# EasyEDA Pro project _MSPM0电赛_2025-06-15-官方红板子.epro

# Schematic Schematic1
Board Name: Board1; Create Date: 2025-06-14; Page Name: P1; Project Name: MSPM0电赛; Schematic Name: Schematic1; Update Date: 2025-06-15; Company: 嘉立创EDA; Page Size: A4; Version: V1.0
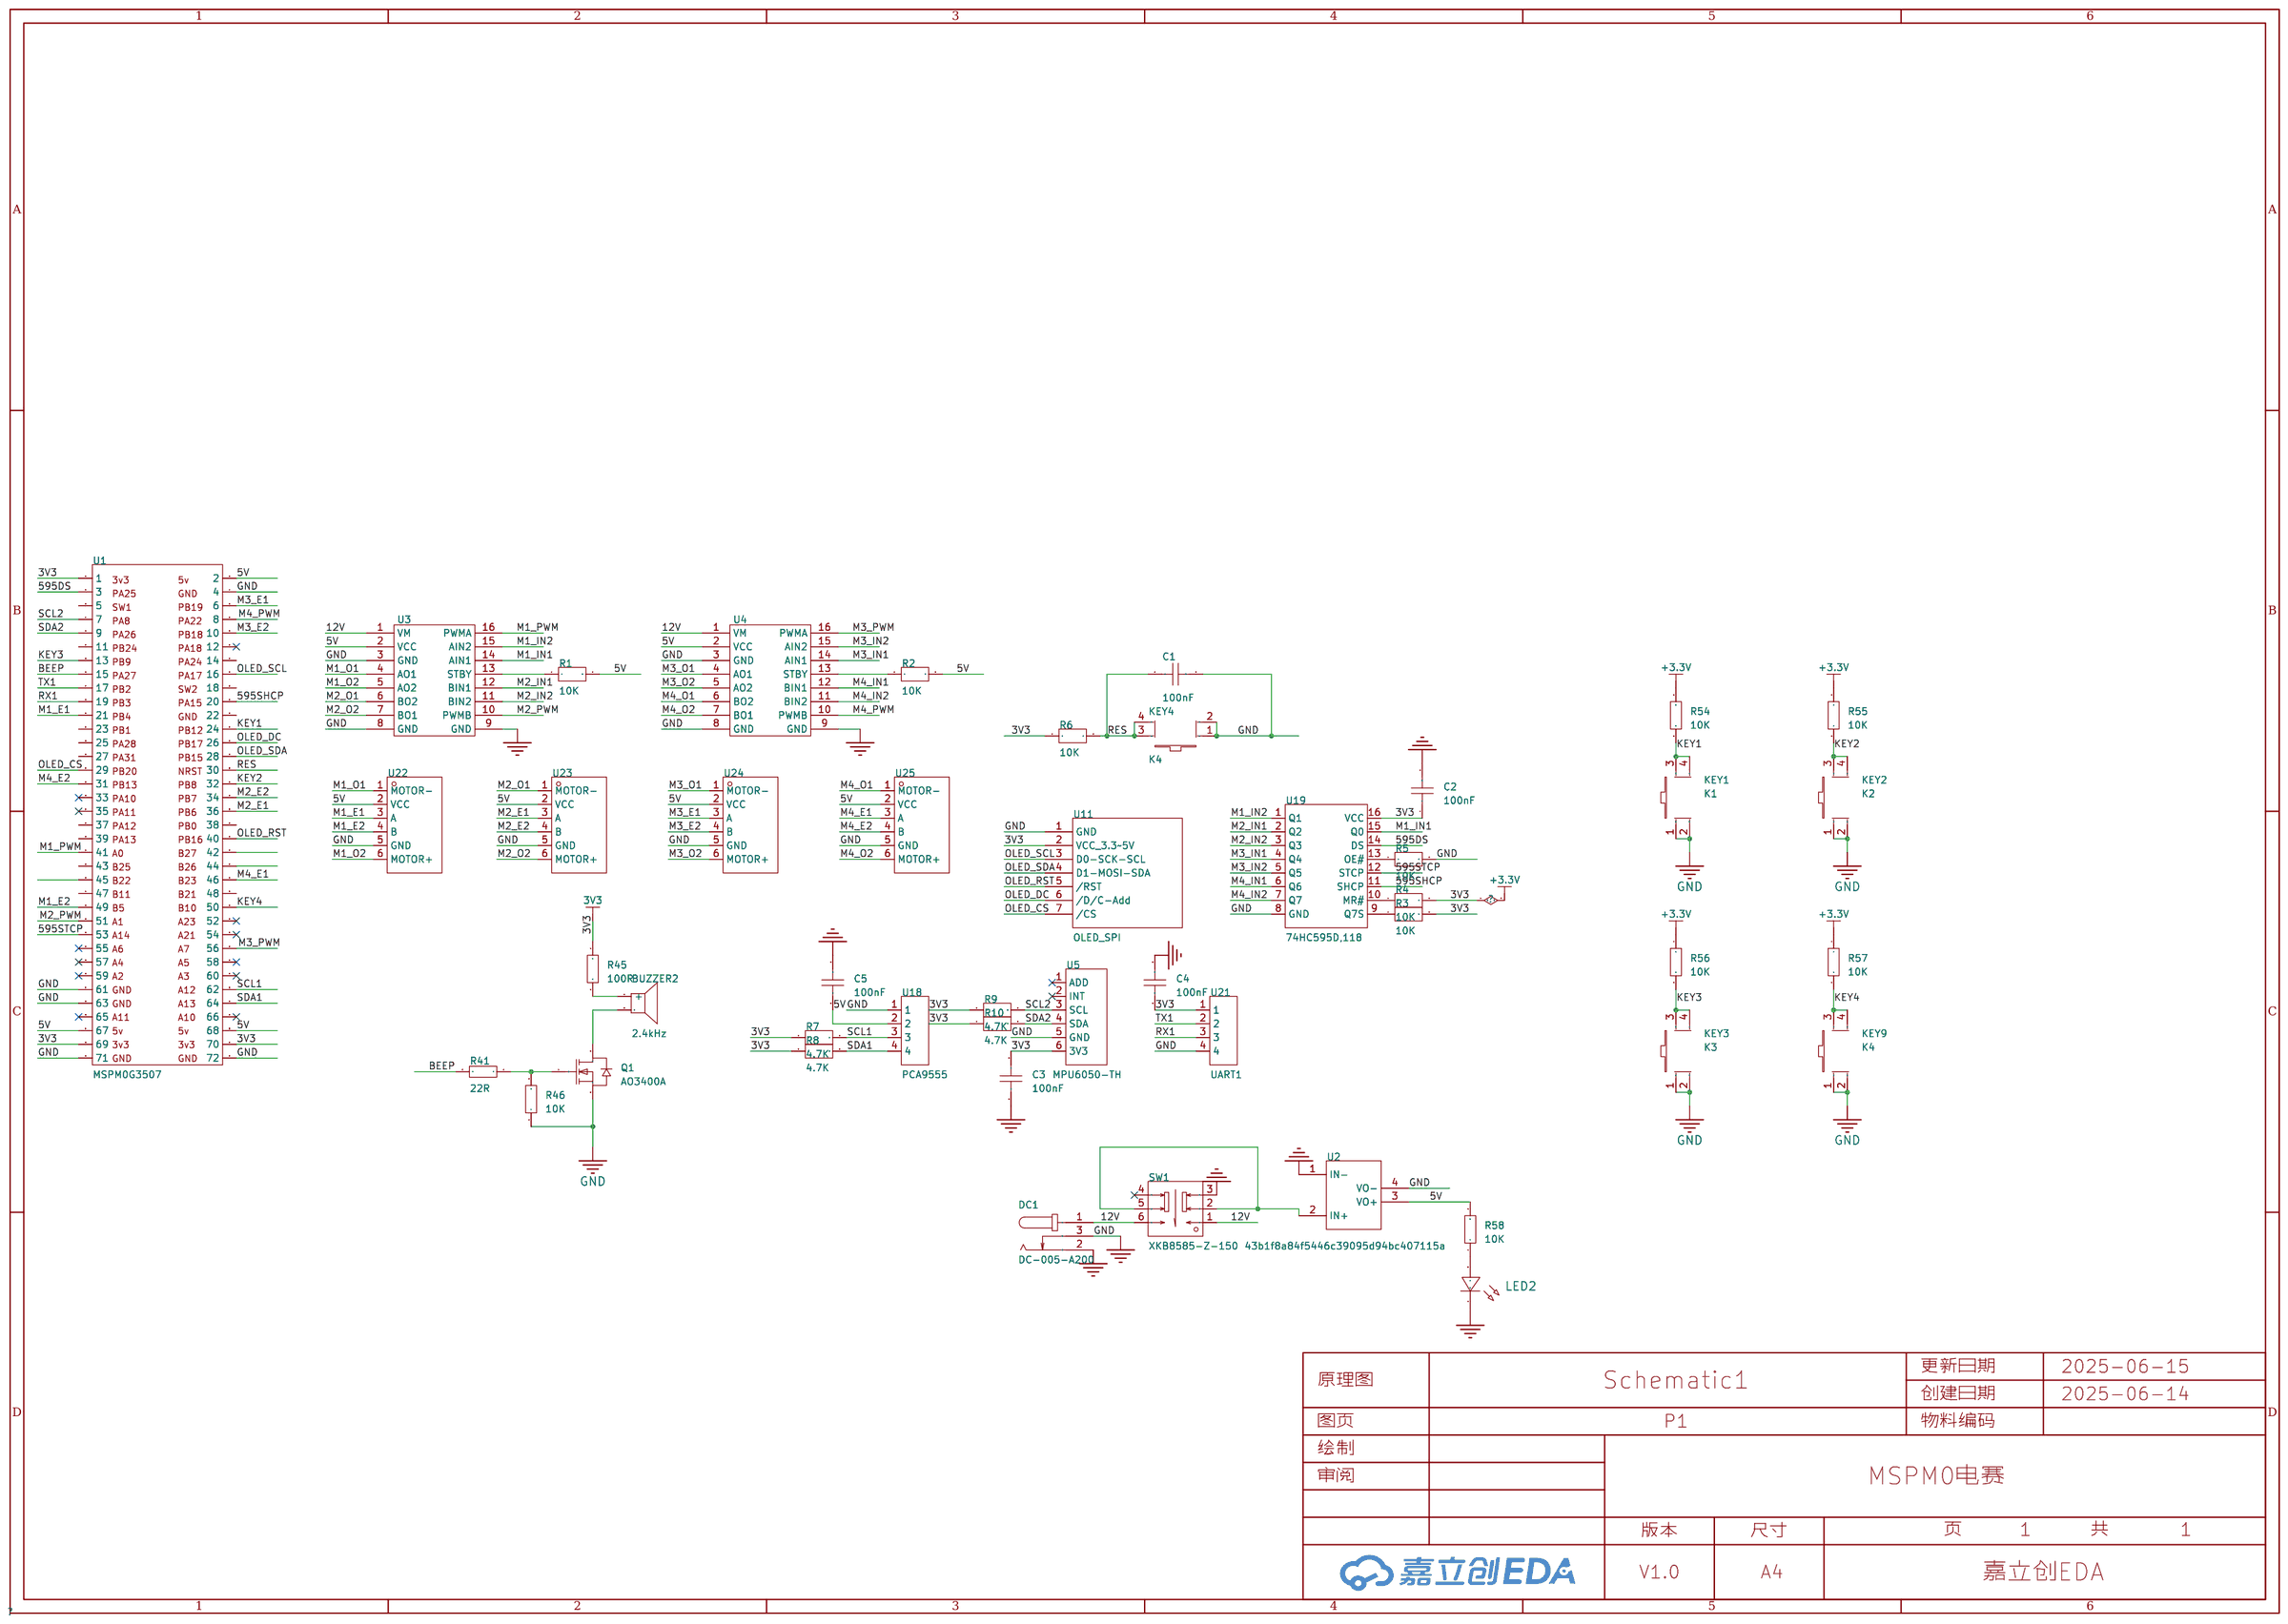
[diagram p0: schematic sheet]

## Parts
BUZZER2  2.4kHz  [BUZ-TH_BD12.0-P7.60-D0.6-FD]
C1  100nF  [C0603]
C2  100nF  [C0603]
C3  100nF  [C0603]
C4  100nF  [C0603]
C5  100nF  [C0603]
DC1  DC-005-A200  [DC-IN-TH_DC-005-A200]
KEY1  K1  [KEY-TH_4P-L6.0-W6.0-P4.50]
KEY2  K2  [KEY-TH_4P-L6.0-W6.0-P4.50]
KEY3  K3  [KEY-TH_4P-L6.0-W6.0-P4.50]
KEY4  K4  [KEY-TH_4P-L6.0-W6.0-P4.50]
KEY9  K4  [KEY-TH_4P-L6.0-W6.0-P4.50]
LED2  -  [LED_0603]
Q1  AO3400A  [SOT-23-3_L2.9-W1.3-P1.90-LS2.4-BR]
R1  10K  [C0603]
R2  10K  [C0603]
R3  10K  [C0603]
R4  10K  [C0603]
R5  10K  [C0603]
R6  10K  [C0603]
R7  4.7K  [C0603]
R8  4.7K  [C0603]
R9  4.7K  [C0603]
R10  4.7K  [C0603]
R41  22R  [R0603]
R45  100R  [R0603]
R46  10K  [R0603]
R54  10K  [R0603]
R55  10K  [R0603]
R56  10K  [R0603]
R57  10K  [R0603]
R58  10K  [R0603]
SW1  XKB8585-Z-150  [SW-TH_6P-L8.5-W8.5-P2.50-LS5.4-BL-1]
U1  MSPM0G3507  [MSPM0G3507]
U2  43b1f8a84f5446c39095d94bc407115a  [AJ41 DC-DC降压电源模块]
U3  -  [TB6612]
U4  -  [TB6612]
U5  MPU6050-TH  [COMM-TH_MPU6050-TH]
U11  OLED_SPI  [0.96OLED_7P]
U18  PCA9555  [CONN-TH_4P-P2.50-XH2.54-4P]
U19  74HC595D,118  [SOIC-16_L9.9-W3.9-P1.27-LS6.0-BL]
U21  UART1  [CONN-TH_4P-P2.50-XH2.54-4P]
U22  -  [ZX-XH2.54-6PWZ]
U23  -  [ZX-XH2.54-6PWZ]
U24  -  [ZX-XH2.54-6PWZ]
U25  -  [ZX-XH2.54-6PWZ]

## Library data of the parts
BUZZER2 = TMB12A05_C96093: 驱动方式:有源(内含驱动线路);构造类型:电磁式;额定电压:-;频率:2.4kHz;声压(SPL):85dB;; LCSC Part Name: TMB12A05; Supplier Part: C96093; Manufacturer: 华能; Manufacturer Part: TMB12A05; Supplier Footprint: 插件,D=12mm; JLCPCB Part Class: 扩展库; Datasheet: https://atta.szlcsc.com/upload/public/pdf/source/20241025/8A17FE04D767D19A35A06DEF9A82AB1E.pdf; Supplier: LCSC; Driver Circuitry: 有源(内含驱动线路); Technology: 电磁式; Voltage - Supply: 4V~8V; Sound Pressure Level(SPL): 85dB; Diameter(φD): 12mm; Height: 9.8mm
C1-C5 = CAP_0603: Supplier Footprint: 0603
DC1 = DC-005-A200: 连接器类型:DC电源插座;安装方式:弯插;触点内径:2mm;触点外径:6.4mm;额定电流:3A;额定电压:30V;工作温度范围:-20℃~+70℃;; LCSC Part Name: DC电源插座 内径:2mm 外径:6.4mm; Supplier Part: C720557; Manufacturer: XUNPU(讯普); Supplier Footprint: 插件; JLCPCB Part Class: 扩展库; Datasheet: https://atta.szlcsc.com/upload/public/pdf/source/20200812/C720557_2286DFCD6C75B71AF905731F627ABF3A.pdf; Supplier: LCSC; Connector Type: DC电源插座; Mounting Style: 弯插; Inside Contact Diameter: 2mm; Outside Contact Diameter: 6.4mm; Current Rating (Max): 3A; Voltage Rating (Max): 30V; Operating Temperature Range: -20℃~+70℃
KEY1-KEY4 KEY9 = 按键开关6*6*8.5: LCSC Part Name: 按键开关6*6*8.5   直插; Supplier Part: C59980; Supplier Footprint: 插件; JLCPCB Part Class: 扩展库; Supplier: LCSC
LED2 = LED_0603-R: Supplier Footprint: 0603
Q1 = AO3400A_C20917: 类型:1个N沟道;漏源电压(Vdss):30V;连续漏极电流(Id):5.7A;导通电阻(RDS(on)@Vgs,Id):26.5mΩ@10V,5.7A;功率(Pd):1.4W;阈值电压(Vgs(th)@Id):1.5V@250uA;; LCSC Part Name: 1个N沟道 耐压:30V 电流:5.7A; Supplier Part: C20917; Manufacturer: AOS; Supplier Footprint: SOT-23-3L; JLCPCB Part Class: 基础库; Datasheet: https://atta.szlcsc.com/upload/public/pdf/source/20140107/1457706668533.pdf; Supplier: LCSC; Type: 1个N沟道; Drain Source Voltage (Vdss): 30V; Continuous Drain Current (Id): 5.7A; Drain Source On Resistance (RDS(on)@Vgs,Id): 26.5mΩ@10V,5.7A; Power Dissipation (Pd): 1.4W; Gate Threshold Voltage (Vgs(th)@Id): 1.5V@250uA; Total Gate Charge (Qg@Vgs): 7nC@4.5V; Input Capacitance (Ciss@Vds): 630pF@15V; Operating Temperature: -55℃~+150℃@(Tj)
R1-R10 = RGT1608P-4990-B-T5: 电阻类型:薄膜电阻;阻值:499Ω;精度:±0.1%;功率:62.5mW;最大工作电压:100V;温度系数:±25ppm/℃;; LCSC Part Name: 薄膜电阻 499Ω ±0.1% 62.5mW; Supplier Part: C2083102; Manufacturer: SUSUMU; Supplier Footprint: 0603; JLCPCB Part Class: 扩展库; Datasheet: https://atta.szlcsc.com/upload/public/pdf/source/20210602/FAF6903AD06801EB9B5BD9535AC54790.pdf; Supplier: LCSC; Type: 薄膜电阻; Tolerance: ±0.1%; Power(Watts): 62.5mW; Overload Voltage (Max): 100V; Temperature Coefficient: ±25ppm/℃; Operating Temperature Range: -55℃~+175℃
R41 R45 R46 R54-R58 = Res_0603: Supplier Footprint: 0603
SW1 = XKB8585-Z-150: 电路结构:-;自锁/无锁:自锁;安装方式:直插;触点电流:100mA;额定电压 (AC):250V;额定电压 (DC):30V;带灯:不带;作用力:160gf;机械寿命:10万次;; LCSC Part Name: 按键开关   六脚 内扣 有声自锁; Supplier Part: C318850; Manufacturer: XKB Connectivity(中国星坤); Supplier Footprint: 插件; JLCPCB Part Class: 扩展库; Datasheet: https://atta.szlcsc.com/upload/public/pdf/source/20200227/C318850_BEC742BC33DEE736D7E5FB22B903A157.pdf; Supplier: LCSC; Self Lock / No Lock: 自锁; Actuator Style: 方形按钮; Mounting Style: 直插; Contact Current: 100mA; Voltage Rating (AC): 250V; Voltage Rating (DC): 30V; Insulation Resistance: 100MΩ; Actuator/Cap Color: 白色; With Lamp: 不带; Pin Style: PC引脚; Operating Force: 160gf; Operating Temperature: -15℃~+55℃; Mechanical Life: 10万次
U1 = MSPM0G3507: _: 3
U2 = AJ41 DC-DC降压电源模块: AJ41 DC-DC降压电源模块 6V-36V转5V
U3 U4 = TB6612
U5 = MPU6050-TH: Supplier Part: C9900132629; Supplier Footprint: 直插; Supplier: LCSC
U11 = OLED_7P: Pin Type: IN
U18 U21 = XH2.54_4P_直插: Supplier Part: C9900008616; Supplier Footprint: XH2.54_4P; JLCPCB Part Class: 扩展库; Supplier: LCSC
U19 = 74HC595D,118: 功能:串行至串行或并行;电源电压:2V~6V;元件数:1;每个元件位数:8;; LCSC Part Name: 三态输出 串行至串行或并行移位寄存器; Supplier Part: C5947; Manufacturer: Nexperia(安世); Supplier Footprint: SOIC-16; JLCPCB Part Class: 基础库; Datasheet: https://atta.szlcsc.com/upload/public/pdf/source/20240724/C3A3241CA190230F407C83CEC4244600.pdf; Supplier: LCSC; Function: 串行至串行或并行; Supply Voltage: 2V~6V; Number of Elements: 1; Number of Bits per Element: 8; Output Type: 三态; Series: 74HC; Operating Temperature: -40℃~+125℃
U22-U25 = Motor-6Pin

## Nets
5V: C5.2 R1.2 R2.2 R58.2 U1.2 U1.67 U1.68 U2.3(VO+) U3.2(VCC) U4.2(VCC) U18.2 U22.2(VCC) U23.2(VCC) U24.2(VCC) U25.2(VCC)
12V: DC1.1 SW1.1 SW1.6 U3.1(VM) U4.1(VM)
+3.3V: C2.1 C3.2 C4.1 R3.2 R4.2 R6.1 R7.1 R8.1 R9.1 R10.1 R45.1 R54.1 R55.1 R56.1 R57.1 U1.1 U1.69 U1.70 U5.6(3V3) U11.2(VCC 3.3~5V) U19.16(VCC) U21.1
GND: C1.2 C2.2 C3.1 C4.2 C5.1 DC1.2 DC1.3 KEY1.1 KEY1.2 KEY2.1 KEY2.2 KEY3.1 KEY3.2 KEY4.1 KEY4.2 KEY9.1 KEY9.2 LED2.1(C) Q1.2(S) R5.2 R46.1 SW1.3 U1.4 U1.61 U1.63 U1.71 U1.72 U2.1(IN-) U2.4(VO-) U3.3(GND) U3.8(GND) U3.9(GND) U4.3(GND) U4.8(GND) U4.9(GND) U5.5(GND) U11.1(GND) U18.1 U19.8(GND) U21.4 U22.5(GND) U23.5(GND) U24.5(GND) U25.5(GND)
595DS: U1.3 U19.14(DS)
595SHCP: U1.20 U19.11(SHCP)
595STCP: U1.53 U19.12(STCP)
BEEP: R41.2 U1.15
KEY1: KEY1.3 KEY1.4 R54.2 U1.24
KEY2: KEY2.3 KEY2.4 R55.2 U1.32
KEY3: KEY3.3 KEY3.4 R56.2 U1.13
KEY4: KEY9.3 KEY9.4 R57.2 U1.50
M1_E1: U1.21 U22.3(A)
M1_E2: U1.49 U22.4(B)
M1_IN1: U3.14(AIN1) U19.15(Q0)
M1_IN2: U3.15(AIN2) U19.1(Q1)
M1_O1: U3.4(AO1) U22.1(MOTOR-)
M1_O2: U3.5(AO2) U22.6(MOTOR+)
M1_PWM: U1.41 U3.16(PWMA)
M2_E1: U1.36 U23.3(A)
M2_E2: U1.34 U23.4(B)
M2_IN1: U3.12(BIN1) U19.2(Q2)
M2_IN2: U3.11(BIN2) U19.3(Q3)
M2_O1: U3.6(BO2) U23.1(MOTOR-)
M2_O2: U3.7(BO1) U23.6(MOTOR+)
M2_PWM: U1.51 U3.10(PWMB)
M3_E1: U1.6 U24.3(A)
M3_E2: U1.10 U24.4(B)
M3_IN1: U4.14(AIN1) U19.4(Q4)
M3_IN2: U4.15(AIN2) U19.5(Q5)
M3_O1: U4.4(AO1) U24.1(MOTOR-)
M3_O2: U4.5(AO2) U24.6(MOTOR+)
M3_PWM: U1.56 U4.16(PWMA)
M4_E1: U1.46 U25.3(A)
M4_E2: U1.31 U25.4(B)
M4_IN1: U4.12(BIN1) U19.6(Q6)
M4_IN2: U4.11(BIN2) U19.7(Q7)
M4_O1: U4.6(BO2) U25.1(MOTOR-)
M4_O2: U4.7(BO1) U25.6(MOTOR+)
M4_PWM: U1.8 U4.10(PWMB)
OLED_CS: U1.29 U11.7(/CS)
OLED_DC: U1.26 U11.6(/D/C-Add)
OLED_RST: U1.40 U11.5(/RST)
OLED_SCL: U1.16 U11.3(D0-SCK-SCL)
OLED_SDA: U1.28 U11.4(D1-MOSI-SDA)
RES: C1.1 KEY4.3 KEY4.4 R6.2 U1.30
RX1: U1.19 U21.3
SCL1: R7.2 U1.62 U18.3
SCL2: R9.2 U1.7 U5.3(SCL)
SDA1: R8.2 U1.64 U18.4
SDA2: R10.2 U1.9 U5.4(SDA)
TX1: U1.17 U21.2
$1N3300: R1.1 U3.13(STBY)
$1N3306: R2.1 U4.13(STBY)
$1N3954: R3.1 U19.9(Q7S)
$1N3999: R4.1 U19.10(MR#)
$1N4038: R5.1 U19.13(OE#)
$1N7175: BUZZER2.2 Q1.3(D)
$1N7178: Q1.1(G) R41.1 R46.2
$1N7182: BUZZER2.1(+) R45.2
$1N9172: LED2.2(A) R58.1
$1N10907: SW1.2 SW1.5 U2.2(IN+)

Not connected (* = marked no-connect by the designer): SW1 4*; U1 5 11 12* 14 18 22 23 25 27 33* 35* 37 38 39 42 43 44 45 47 48 52* 54* 55* 57* 58* 59* 60* 65* 66*; U5 1(ADD)* 2(INT)*

# Board PCB1
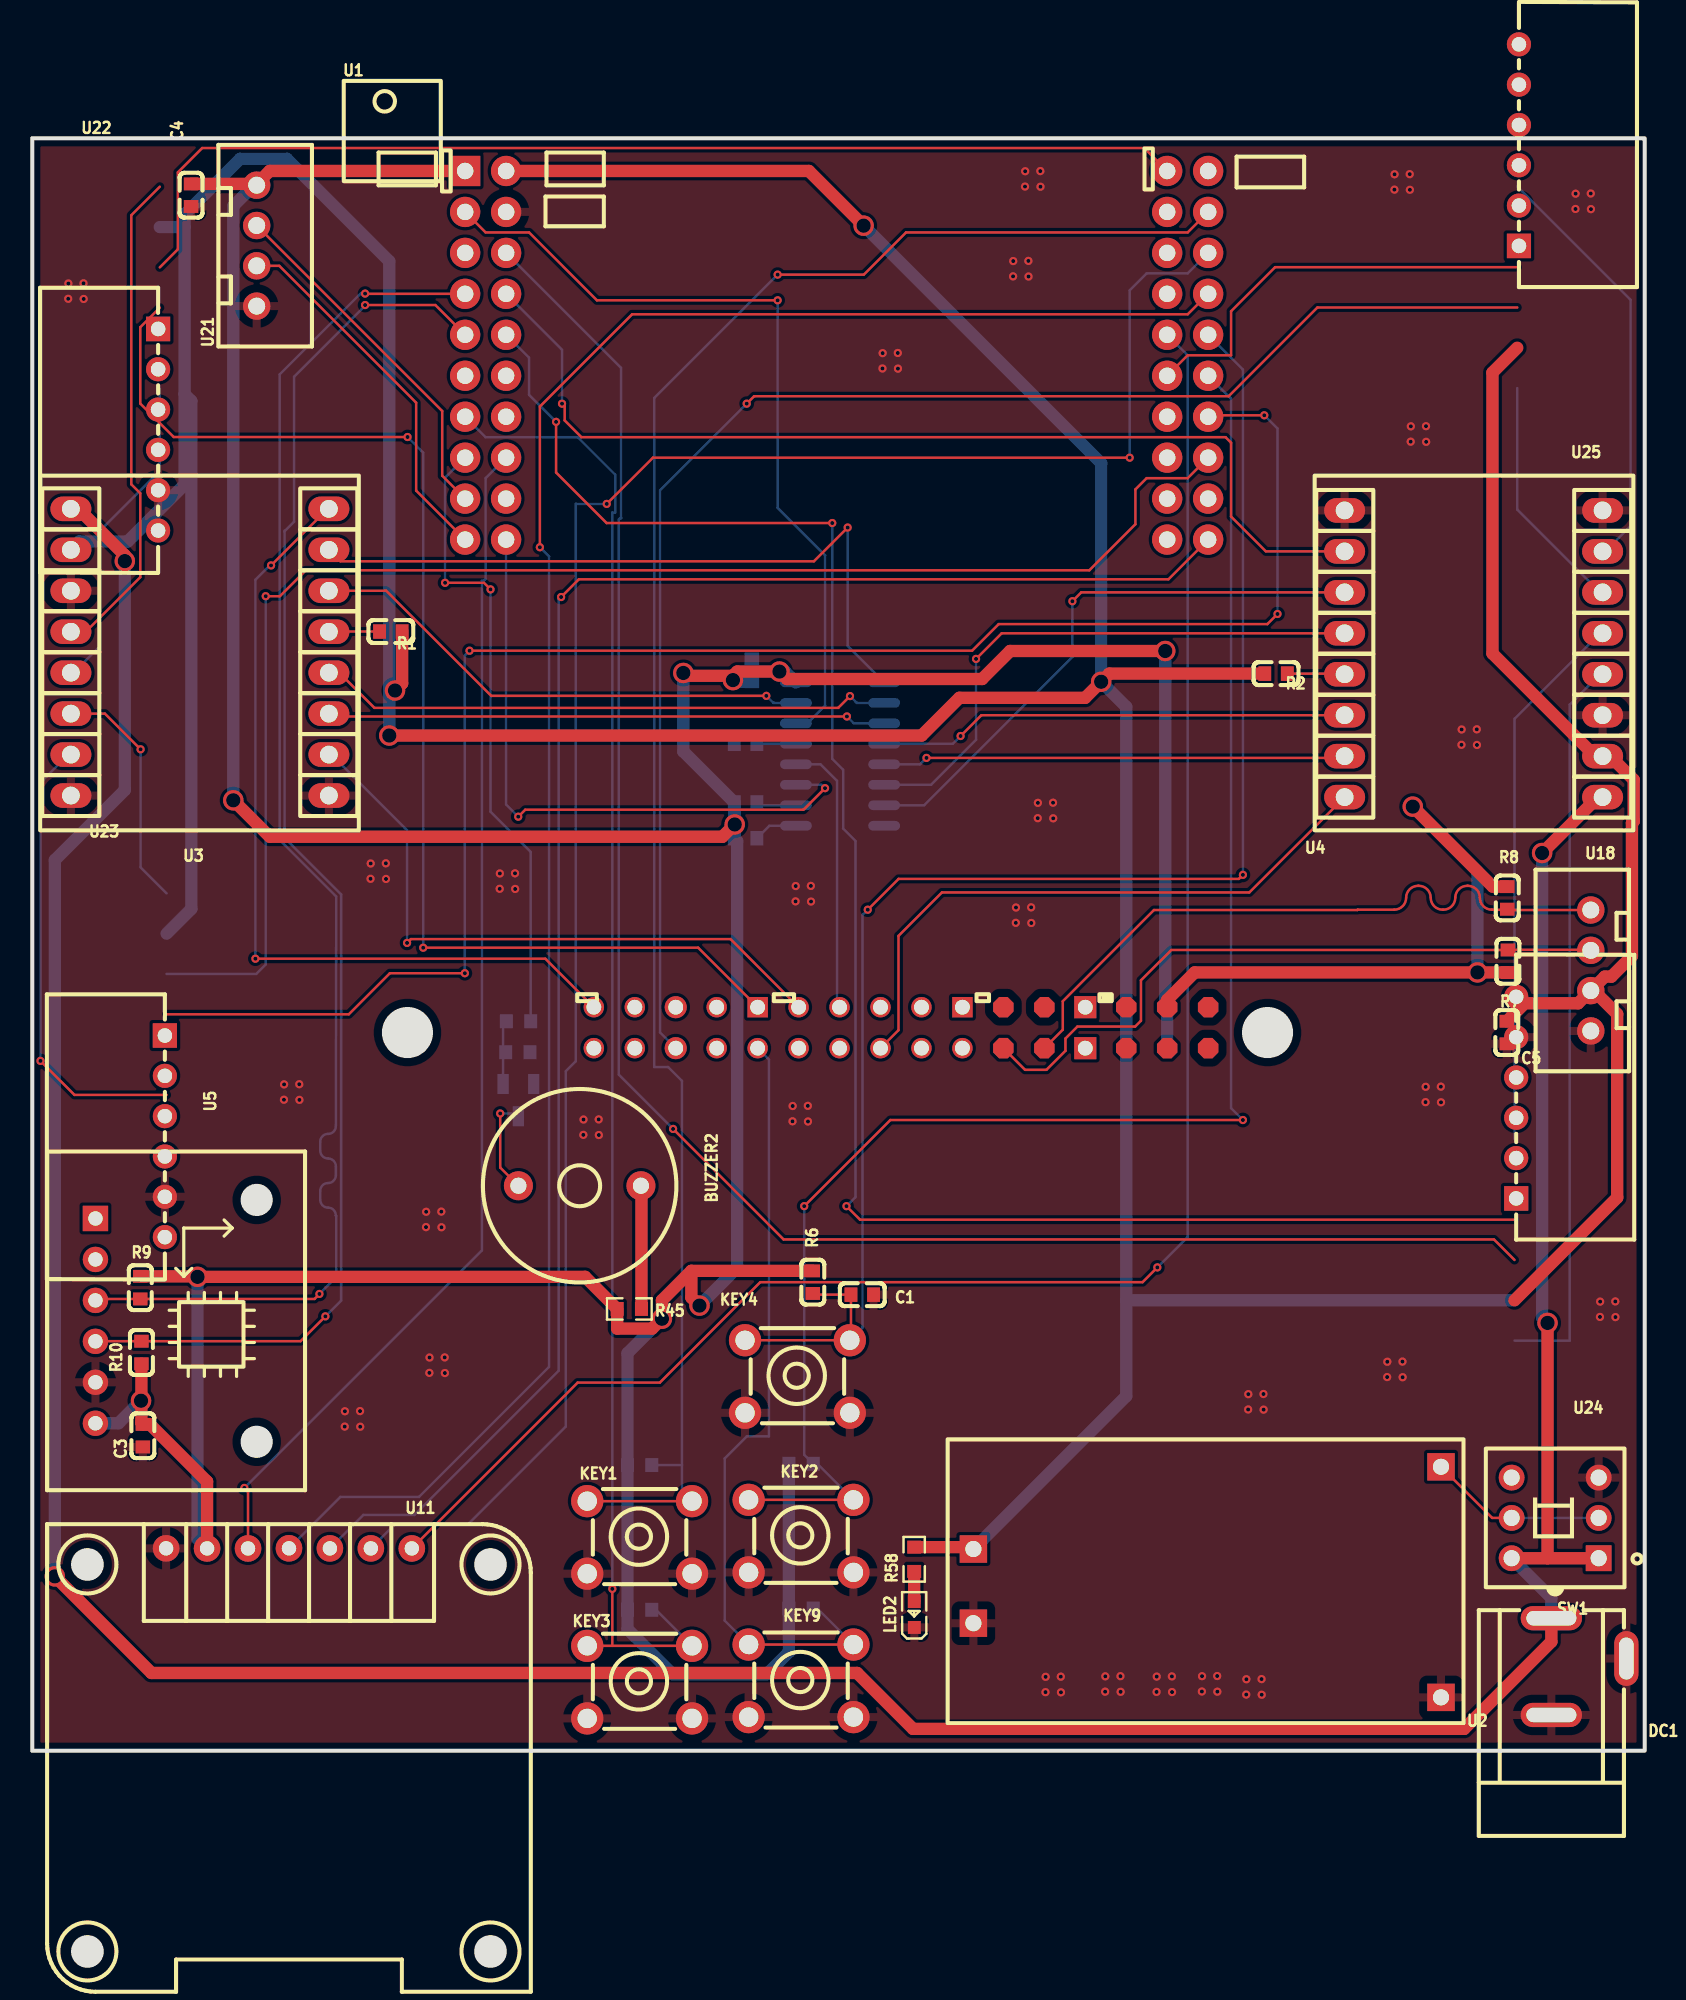
[diagram p1: board, top side]
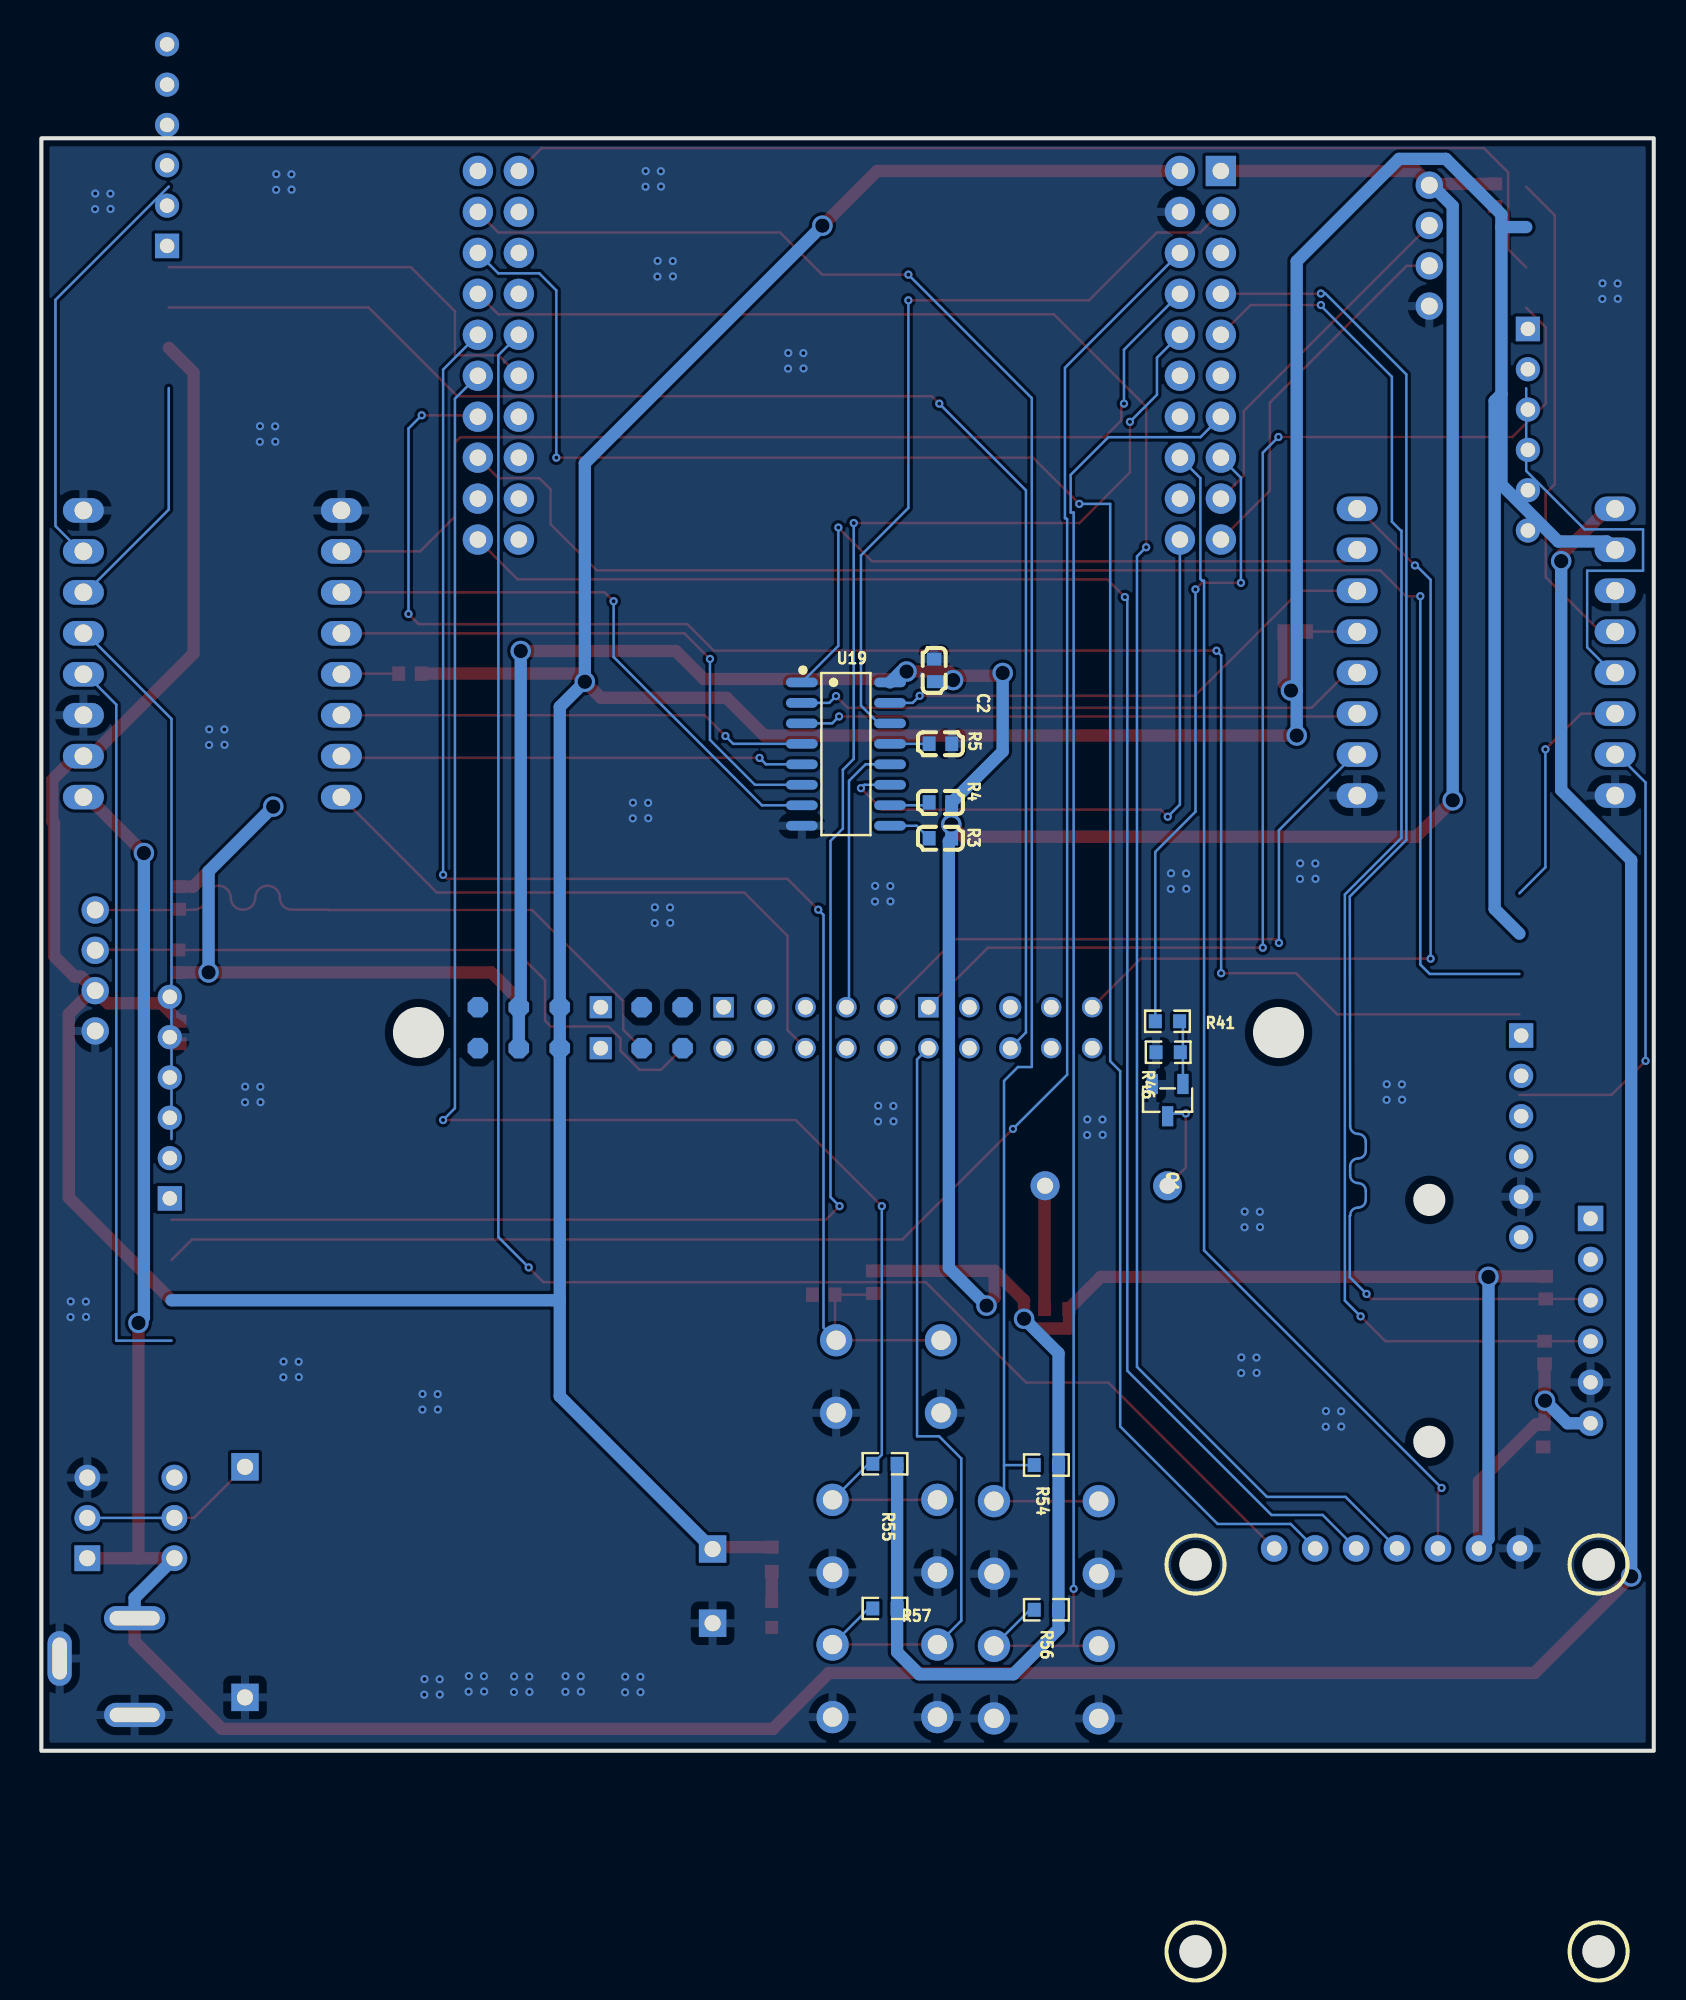
[diagram p2: board, bottom side, seen from below]

Outline 100 x 113.46 mm; copper layers: Top Layer, Bottom Layer. Coordinates in mm from the lower left corner of the outline.
Outline path: rectangle 0,113.46 100,13.46
Stack: Top Layer 0.035mm / Dielectric1 1.51mm FR4 er 4.5 / Bottom Layer 0.035mm

## Design rules (mm)
net SCL2: DP1
net SDA2: DP1
net GND: GND
net 5V: PWO
net SCL1: DP2
net SDA1: DP2
net 12V: PPWO
net $1N7182: PWO
net +3.3V: PWO
net $1N9172: PWO
template: 双
spacing copperThickness1oz (default): track to track 0.203, other pairs 0.152 to 0.203
spacing copperThickness2oz: track to track 0.203, other pairs 0.152 to 0.3
track width 信号线 (default): min 0.152, default 0.152, max 0.152
track width 电源线: min 0.762, default 0.762, max 0.762
differential pair differentialPair (default): width min 0.152, default 0.152, max 0.152; gap min 0.152, default 0.152
via 信号线孔 (default): diameter min 0.508, default 0.508, max 0.508; hole min 0.254, default 0.254, max 0.305
via 电源: diameter min 0.762, default 1.27, max 2.032; hole min 0.762, default 0.889, max 2.032
net class PWO uses 电源, 电源线
net class PPWO uses 电源, 电源线
net 5V uses 电源, 电源线
net 12V uses 电源, 电源线
net $1N7182 uses 电源, 电源线
net +3.3V uses 电源, 电源线
net $1N9172 uses 电源, 电源线

## Placement (name value [footprint] x y rotation side)
BUZZER2  2.4kHz  [BUZ-TH_BD12.0-P7.60-D0.6-FD]  33.95 48.5 180 top
C1  100nF  [C0603]  51.48 41.74 0 top
C2  100nF  [C0603]  44.63 80.46 90 bottom
C3  100nF  [C0603]  6.86 33 90 top
C4  100nF  [C0603]  9.85 109.93 270 top
C5  100nF  [C0603]  91.45 58 90 top
DC1  DC-005-A200  [DC-IN-TH_DC-005-A200]  96.54 18.68 90 top
KEY1  K1  [KEY-TH_4P-L6.0-W6.0-P4.50]  37.67 26.69 0 top
KEY2  K2  [KEY-TH_4P-L6.0-W6.0-P4.50]  47.68 26.77 0 top
KEY3  K3  [KEY-TH_4P-L6.0-W6.0-P4.50]  37.67 17.71 0 top
KEY4  K4  [KEY-TH_4P-L6.0-W6.0-P4.50]  47.46 36.66 0 top
KEY9  K4  [KEY-TH_4P-L6.0-W6.0-P4.50]  47.68 17.79 0 top
LED2  -  [LED_0603]  54.7 21.96 90 top
Q1  AO3400A  [SOT-23-3_L2.9-W1.3-P1.90-LS2.4-BR]  30.15 53.81 90 bottom
R1  10K  [C0603]  22.24 82.87 0 top
R2  10K  [C0603]  77.14 80.26 180 top
R3  10K  [C0603]  44.24 70.05 180 bottom
R4  10K  [C0603]  44.24 72.27 180 bottom
R5  10K  [C0603]  44.24 75.91 180 bottom
R6  10K  [C0603]  48.41 42.52 270 top
R7  4.7K  [C0603]  91.52 62.42 90 top
R8  4.7K  [C0603]  91.48 66.35 270 top
R9  4.7K  [C0603]  6.7 42.18 270 top
R10  4.7K  [C0603]  6.77 38.16 90 top
R41  22R  [R0603]  30.16 58.7 0 bottom
R45  100R  [R0603]  37.03 40.86 0 top
R46  10K  [R0603]  30.12 56.78 180 bottom
R54  10K  [R0603]  37.67 31.17 0 bottom
R55  10K  [R0603]  47.68 31.25 0 bottom
R56  10K  [R0603]  37.67 22.2 0 bottom
R57  10K  [R0603]  47.68 22.28 0 bottom
R58  10K  [R0603]  54.7 25.33 90 top
SW1  XKB8585-Z-150  [SW-TH_6P-L8.5-W8.5-P2.50-LS5.4-BL-1]  94.45 27.9 90 top
U1  -  [MSPM0G3507]  47.26 86.54 0 top
U2  43b1f8a84f5446c39095d94bc407115a  [AJ41 DC-DC降压电源模块]  73.47 24.57 180 top
U3  -  [TB6612]  0.34 70.49 0 top
U4  -  [TB6612]  99.45 92.59 180 top
U5  MPU6050-TH  [COMM-TH_MPU6050-TH]  3.92 40.12 270 top
U11  OLED_SPI  [0.96OLED_7P]  15.92 26.01 0 top
U18  PCA9555  [CONN-TH_4P-P2.50-XH2.54-4P]  96.66 61.85 270 top
U19  74HC595D,118  [SOIC-16_L9.9-W3.9-P1.27-LS6.0-BL]  50.1 75.27 270 bottom
U21  UART1  [CONN-TH_4P-P2.50-XH2.54-4P]  13.92 106.8 90 top
U22  -  [ZX-XH2.54-6PWZ]  7.91 104.21 270 top
U23  -  [ZX-XH2.54-6PWZ]  8.33 60.39 270 top
U24  -  [ZX-XH2.54-6PWZ]  91.93 45.14 90 top
U25  -  [ZX-XH2.54-6PWZ]  92.1 104.21 90 top

## Footprints (pads in the part's own frame, mm; a bottom-side part is the same pattern mirrored in y, then rotated)
0.96OLED_7P
  round 1.651 hole 0.889: 1(-7.617,0.003) 2(-5.077,-0.003) 3(-2.538,-0.003) 4(0.003,0.005) 5(2.54,0) 6(5.08,0) 7(7.62,-0.003)
AJ41 DC-DC降压电源模块
  rect 1.7x1.7 hole 1: 1(-13.9,7.8) 2(-13.9,-6.5) 3(15.1,-1.4) 4(15.1,3.2)
BUZ-TH_BD12.0-P7.60-D0.6-FD
  round 1.8 hole 1: 1(-3.8,0) 2(3.8,0)
C0603
  rect 0.8x0.9 smd: 1(-0.7,0) 2(0.7,0)
COMM-TH_MPU6050-TH
  rect 1.575x1.575 hole 0.889: 1(-6.35,0)
  round 1.575 hole 0.889: 2(-3.81,0) 3(-1.27,0) 4(1.27,0) 5(3.81,0) 6(6.35,0)
CONN-TH_4P-P2.50-XH2.54-4P
  round 1.7 hole 1.05: 1(3.75,0) 2(1.25,0) 3(-1.25,0) 4(-3.75,0)
DC-IN-TH_DC-005-A200
  oval 1.5x3.8 hole 0.9x3.1: 1(3,2.325) 2(-3,2.325)
  oval 3.4x1.5 hole 2.6x0.9: 3(0.5,-2.325)
KEY-TH_4P-L6.0-W6.0-P4.50
  round 2 hole 1.2: 1(-3.25,-2.25) 2(3.25,-2.25) 3(3.25,2.25) 4(-3.25,2.25)
LED_0603
  rect 0.8x0.8 smd: 1(-0.851,-0.01) 2(0.75,-0.005)
MSPM0G3507
  rect 1.879x1.879 hole 1.021x1.016: 1(-20.412,24.892)
  round 1.879 hole 1.021x1.016: 2(-17.872,24.892) 3(-20.412,22.352) 4(-17.872,22.352) 5(-20.412,19.812) 6(-17.872,19.812) 7(-20.412,17.272) 8(-17.872,17.272) 9(-20.412,14.732) 10(-17.872,14.732) 11(-20.412,12.192) 12(-17.872,12.192) 13(-20.412,9.652) 14(-17.872,9.652) 15(-20.412,7.112) 16(-17.872,7.112) 17(-20.412,4.572) 18(-17.872,4.572) 19(-20.412,2.032) 20(-17.872,2.032) 21(23.128,24.892) 22(25.668,24.892) 23(23.128,22.352) 24(25.668,22.352) 25(23.128,19.812) 26(25.668,19.812) 27(23.128,17.272) 28(25.668,17.272) 29(23.128,14.732) 30(25.668,14.732) 31(23.128,12.192) 32(25.668,12.192) 33(23.128,9.652) 34(25.668,9.652) 35(23.128,7.112) 36(25.668,7.112) 37(23.128,4.572) 38(25.668,4.572) 39(23.128,2.032) 40(25.668,2.032)
  round 1.267 hole 0.919x0.914: 41(-12.431,-26.968) 42(-12.431,-29.508) 43(-9.892,-26.968) 44(-9.892,-29.508) 47(-4.811,-26.968) 48(-4.811,-29.508) 50(-2.272,-29.508) 51(0.269,-26.968) 52(0.269,-29.508) 53(2.808,-26.968) 54(2.808,-29.508) 55(5.348,-26.968) 56(5.348,-29.508) 57(7.888,-26.968) 58(7.888,-29.508) 60(10.428,-29.508)
  round 1.371 hole 0.919x0.914: 45(-7.351,-26.968) 46(-7.351,-29.508)
  rect 1.267x1.267 hole 0.919x0.914: 49(-2.272,-26.968) 59(10.428,-26.968)
  custom 1.268x1.267 hole 0.919x0.914: 61(12.969,-26.968) 62(12.969,-29.508) 63(15.508,-26.968) 64(15.508,-29.508) 67(20.588,-26.968) 68(20.588,-29.508) 69(23.128,-26.968) 70(23.128,-29.508) 72(25.669,-29.508)
  rect 1.371x1.371 hole 0.919x0.914: 65(18.049,-26.968) 66(18.049,-29.508)
  custom 1.268x1.267 hole 0.914x0.919: 71(25.668,-26.968)
R0603
  rect 0.806x0.864 smd: 1(-0.753,0) 2(0.753,0)
SOIC-16_L9.9-W3.9-P1.27-LS6.0-BL
  oval 0.602x1.971 smd: 1(-4.445,-2.736) 2(-3.175,-2.736) 3(-1.905,-2.736) 4(-0.635,-2.736) 5(0.635,-2.736) 6(1.905,-2.736) 7(3.175,-2.736) 8(4.445,-2.736) 9(4.445,2.736) 10(3.175,2.736) 11(1.905,2.736) 12(0.635,2.736) 13(-0.635,2.736) 14(-1.905,2.736) 15(-3.175,2.736) 16(-4.445,2.736)
SOT-23-3_L2.9-W1.3-P1.90-LS2.4-BR
  rect 1.25x0.7 smd: 1(1,-0.95) 2(1,0.95) 3(-1,0)
SW-TH_6P-L8.5-W8.5-P2.50-LS5.4-BL-1
  rect 1.6x1.6 hole 1: 1(-2.5,-2.7)
  round 1.6 hole 1: 2(0,-2.7) 3(2.5,-2.7) 4(2.5,2.7) 5(0.001,2.7) 6(-2.5,2.7)
TB6612
  oval 2.54x1.524 hole 1.1: 1(2.057,19.988) 2(2.057,17.448) 3(2.057,14.908) 4(2.057,12.368) 5(2.057,9.828) 6(2.057,7.288) 7(2.057,4.748) 8(2.057,2.208) 9(18.057,2.208) 10(18.057,4.748) 11(18.057,7.288) 12(18.057,9.828) 13(18.057,12.368) 14(18.057,14.908) 15(18.057,17.448) 16(18.057,19.988)
ZX-XH2.54-6PWZ
  rect 1.524x1.5 hole 0.9: 1(2.575,-0.104)
  round 1.5 hole 0.9: 2(5.074,-0.104) 3(7.574,-0.104) 4(10.075,-0.104) 5(12.575,-0.104) 6(15.075,-0.104)

## Nets
As in the schematic.

Pads without a net: SW1 4; U1 5 11 12 14 18 22 23 25 27 33 35 37 38 39 43 47 48 52 54 55 57 58 59 60 65 66; U5 1 2

## Via types
v1: diameter 0.508, hole 0.254, Top Layer to Bottom Layer, 160 vias
v2: diameter 1.27, hole 0.889, Top Layer to Bottom Layer, 20 vias

## Routing (per net, layer and track width the routed paths; a pad name or vN(x,y) marks a point on that pad's centre or on a via; arc(x,y) is an arc through that point)
5V: length 386.3
  Top Layer w0.762: U2.3 58.25,26.08 R58.2 ; U18.2 96.84,60.6 98.3,59.14 98.3,47.76 91.93,41.39 ; U18.2 95.88,59.81 92.57,59.81 C5.2 ; U18.2 97.53,61.47 97.94,61.47 99.21,62.74 99.21,70.99 99.32,71.1 99.32,73.67 97.86,75.14 U4.2 96.93,75.14 90.56,81.5 90.56,98.93 92.1,100.46 ; v2(51.56,108.04) 48.17,111.43 U1.2 ; v2(22.5,79.21) 22.94,79.65 R1.2 ; v2(22.14,76.42) 55.16,76.42 57.5,78.76 65.3,78.76 v2(66.29,79.75) 66.8,80.26 R2.2
  Bottom Layer w0.762: 22.14,79.21 22.14,105.83 15.8,112.18 12.89,112.18 9.45,108.73 9.45,107.95 ; 22.14,79.21 v2(22.5,79.21) ; 22.14,79.21 v2(22.14,76.42) ; 67.85,41.39 91.93,41.39 ; 67.85,41.39 67.85,35.45 U2.3 ; 67.85,41.39 U1.68 U1.67 67.85,78.2 v2(66.29,79.75) 66.29,93.3 v2(51.56,108.04) ; 9.45,97.59 9.45,91.98 5.92,88.45 2.92,88.45 U3.2 ; 9.45,97.59 9.45,107.95 ; 9.45,97.59 9.87,97.17 9.87,65.67 8.33,64.13 ; 9.45,107.95 7.91,107.95
12V: length 229.3
  Top Layer w0.762: U4.1 97.11,72.6 v2(93.64,69.13) ; 93.98,25.4 SW1.1 ; 93.98,25.4 SW1.6 ; 93.98,25.4 v2(93.98,39.99) ; U3.1 2.86,90.48 5.74,87.6 v2(5.74,87.23) ; DC1.1 94.21,20.22 88.8,14.81 54.63,14.81 51.16,18.28 7.39,18.28 v2(1.4,24.27)
  Bottom Layer w0.762: v2(93.98,39.99) 93.64,40.33 v2(93.64,69.13) ; v2(5.74,87.23) 5.74,73.04 1.4,68.7 v2(1.4,24.27) ; DC1.1 94.21,22.93 SW1.6
+3.3V: length 357.9
  Top Layer w0.762: 91.52,61.73 v2(89.63,61.73) 72.09,61.73 70.39,60.02 U1.69 ; R8.1 90.58,67.05 v2(85.62,72.01) ; R9.1 10.22,42.88 v2(10.25,42.85) 34.29,42.85 R45.1 36.28,39.64 38.44,39.64 v2(39.05,40.25) 39.05,41.39 40.88,43.22 ; 43.46,80.12 40.55,80.12 v2(40.38,80.3) ; 43.46,80.12 v2(43.46,79.85) ; 43.46,80.12 43.72,80.39 v2(46.34,80.39) 46.8,79.92 58.91,79.92 60.65,81.66 v2(70.27,81.66) ; 13.92,110.63 14.72,111.43 U1.1 ; 13.92,110.63 C4.1 ; 13.92,110.63 U21.1 ; R6.1 40.88,43.22 ; 40.88,43.22 40.88,41.57 v2(41.38,41.06) ; v2(43.57,70.9) 42.8,70.14 14.73,70.14 v2(12.47,72.4) ; 6.77,35.16 6.77,33.79 C3.2 7.3,33.7 10.84,30.16 U11.2 ; 6.77,35.16 R10.1 ; 6.77,35.16 v2(6.75,35.16)
  Bottom Layer w0.762: v2(12.47,72.4) 12.47,109.26 13.76,110.55 U21.1 ; C2.1 43.55,79.76 v2(43.46,79.85) ; v2(89.63,61.73) 89.63,68 v2(85.62,72.01) ; v2(10.25,42.85) 10.25,26.6 U11.2 ; v2(46.34,80.39) 46.69,80.39 U19.16 ; v2(41.38,41.06) 43.72,43.4 43.72,69.87 R3.2 R4.2 ; U1.70 U1.69 70.27,59.69 v2(70.27,81.66) ; v2(39.05,40.25) 36.92,38.11 R54.1 R56.1 36.92,21 39.72,18.2 45.55,18.2 46.93,19.57 R57.1 R55.1 ; v2(40.38,80.3) 40.38,75.43 R4.2 ; v2(6.75,35.16) 5.35,33.77 U5.6 ; R4.2 43.57,72.24 v2(43.57,70.9)
GND:
  vias: v1(2.24,104.45) v1(2.23,103.5) v1(3.18,104.46) v1(3.19,103.49) v1(15.62,54.78) v1(15.61,53.83) v1(16.56,54.79) v1(16.57,53.82) v1(19.39,34.51) v1(19.38,33.56) v1(20.33,34.52) v1(20.34,33.55) v1(20.99,68.48) v1(20.98,67.53) v1(21.93,68.49) v1(21.94,67.52) v1(24.43,46.88) v1(24.42,45.93) v1(24.64,37.84) v1(24.63,36.89) v1(25.37,46.89) v1(25.38,45.92) v1(25.58,37.85) v1(25.59,36.88) v1(29,67.86) v1(28.99,66.91) v1(29.94,67.87) v1(29.95,66.9) v1(34.19,52.6) v1(34.18,51.65) v1(35.13,52.61) v1(35.14,51.64) v1(47.16,53.44) v1(47.15,52.49) v1(47.35,67.08) v1(47.34,66.13) v1(48.1,53.45) v1(48.11,52.48) v1(48.29,67.09) v1(48.3,66.12) v1(52.74,100.13) v1(52.73,99.18) v1(53.68,100.14) v1(53.69,99.17) v1(60.84,105.84) v1(60.83,104.89) v1(61.01,65.75) v1(61,64.8) v1(61.58,111.41) v1(61.57,110.46) v1(61.78,105.85) v1(61.79,104.88) v1(61.95,65.76) v1(61.96,64.79) v1(62.37,72.24) v1(62.36,71.29) v1(62.52,111.42) v1(62.53,110.45) v1(62.85,18.04) v1(62.84,17.09) v1(63.31,72.25) v1(63.32,71.28) v1(63.79,18.05) v1(63.8,17.08) v1(66.54,17.12) v1(66.55,18.07) v1(67.49,18.08) v1(67.5,17.11) v1(69.74,18.06) v1(69.73,17.11) v1(70.68,18.07) v1(70.69,17.1) v1(72.54,17.13) v1(72.55,18.08) v1(73.49,18.09) v1(73.5,17.12) v1(75.3,17.89) v1(75.29,16.94) v1(75.42,35.57) v1(75.41,34.62) v1(76.24,17.9) v1(76.25,16.93) v1(76.36,35.58) v1(76.37,34.61) v1(84.04,37.58) v1(84.03,36.63) v1(84.49,111.22) v1(84.48,110.27) v1(84.98,37.59) v1(84.99,36.62) v1(85.43,111.23) v1(85.44,110.26) v1(85.5,95.59) v1(85.49,94.64) v1(86.44,95.6) v1(86.45,94.63) v1(86.42,54.63) v1(86.41,53.68) v1(87.36,54.64) v1(87.37,53.67) v1(88.64,75.84) v1(88.65,76.79) v1(89.59,76.8) v1(89.6,75.83) v1(95.72,110.02) v1(95.71,109.07) v1(96.66,110.03) v1(96.67,109.06) v1(97.24,41.31) v1(97.23,40.36) v1(98.18,41.32) v1(98.19,40.35)
595DS: length 50.3
  Top Layer w0.152: 26.85,108.89 28.12,107.62 30.81,107.62 35.02,103.41 v1(46.23,103.41)
  Bottom Layer w0.152: U19.14 48.07,77.17 49.17,78.27 49.17,87.59 46.23,90.53 v1(46.23,103.41)
595SHCP: length 39.1
  Top Layer w0.152: v1(49.17,73.15) 47.83,71.82 30.57,71.82 v1(30.14,71.38)
  Bottom Layer w0.152: v1(30.14,71.38) 29.39,72.14 U1.20 ; U19.11 48.96,73.36 v1(49.17,73.15)
595STCP: length 17.1
  Bottom Layer w0.152: U19.12 48.88,74.63 49.91,73.61 49.91,59.73 U1.53
BEEP: length 39.1
  Top Layer w0.152: v1(28.42,85.48) 28.01,85.89 v1(25.6,85.89)
  Bottom Layer w0.152: 26.85,93.65 25.6,92.41 v1(25.6,85.89) ; R41.2 30.91,69.2 28.42,71.69 v1(28.42,85.48)
KEY1: length 117.4
  Top Layer w0.152: KEY1.4 KEY1.3 ; 72.93,108.89 71.66,107.62 54.19,107.62 51.57,105 v1(46.23,105)
  Bottom Layer w0.152: KEY1.3 40.3,29.56 40.3,31.17 ; 40.3,31.17 R54.2 ; 40.3,31.17 40.3,55 39.43,55.86 38.57,55.86 38.57,97.35 v1(46.23,105)
KEY2: length 102.6
  Top Layer w0.152: KEY2.4 KEY2.3 ; v1(47.88,47.23) 53.22,52.57 v1(75.08,52.57)
  Bottom Layer w0.152: KEY2.3 48.69,31.25 48.43,31.25 47.88,31.81 v1(47.88,47.23) ; v1(75.08,52.57) 74.35,53.31 74.35,97.31 72.93,98.73
KEY3: length 93.5
  Top Layer w0.152: 35.98,19.96 KEY3.3 ; 35.98,19.96 KEY3.4 ; 35.98,19.96 v1(35.98,23.5)
  Bottom Layer w0.152: v1(35.98,23.5) 35.98,90.25 36.16,90.25 36.16,92.58 33.83,94.92 28.12,94.92 26.85,96.19 ; KEY3.3 38.68,22.2 R56.2
KEY4: length 49.8
  Top Layer w0.152: KEY9.4 KEY9.3
  Bottom Layer w0.152: 48.43,22.28 48.69,22.28 KEY9.3 ; KEY9.4 42.95,21.53 42.95,31.59 44.32,32.96 45.69,32.96 45.69,56.33 U1.50
M1_E1: length 68.9
  Top Layer w0.152: 7.91,105.45 9.03,106.57 9.03,111.34 10.54,112.85 68.97,112.85 U1.21
M1_E2: length 78.2
  Top Layer w0.152: U1.49 41.3,63.26 v1(24.25,63.26) ; 7.91,102.95 6.7,101.74 6.7,97 8.77,94.93 v1(23.28,94.93)
  Bottom Layer w0.152: v1(24.25,63.26) 24.25,93.96 v1(23.28,94.93)
M1_IN1: length 31.8
  Top Layer w0.152: v1(45.53,78.88) 28.47,78.88 21.95,85.4 U3.14
  Bottom Layer w0.152: v1(45.53,78.88) 45.96,78.44 U19.15
M1_IN2: length 43.9
  Top Layer w0.152: U3.15 19.11,87.22 48.48,87.22 v1(50.57,89.32)
  Bottom Layer w0.152: U19.1 50.57,81.98 v1(50.57,89.32)
M1_O1: length 30.9
  Top Layer w0.152: U3.4 3.32,82.86 6.7,86.24 6.7,91.44 6.14,92 6.14,108.68 7.91,110.45
M1_O2: length 27
  Bottom Layer w0.152: U3.5 2.56,80.32 4.13,81.89 4.13,86.64 0.66,86.64 0.66,89.21 4.29,89.21 7.91,92.83 7.91,97.95
M1_PWM: length 52.2
  Top Layer w0.152: v1(13.84,62.58) 31.82,62.58 U1.41 ; v1(14.81,86.97) 18.32,90.48 U3.16
  Bottom Layer w0.152: 14.76,87 13.84,86.08 v1(13.84,62.58) ; 18.24,90.48 U3.16
M2_E1: length 92.5
  Top Layer w0.152: 72.93,93.65 71.66,92.38 69.12,92.38 68.42,91.68 68.42,89.52 65.56,86.66 16.97,86.66 15.36,85.06 v1(14.48,85.06)
  Bottom Layer w0.152: v1(14.48,85.06) 14.48,62.22 13.89,61.63 8.33,61.63
M2_E2: length 106.9
  Top Layer w0.152: v1(26.83,61.68) 22.18,61.68 19.63,59.13 8.33,59.13 ; v1(27.12,81.68) 58.29,81.68 59.94,83.33 76.6,83.33 v1(77.23,83.96) ; v1(76.41,96.28) 73.02,96.28 U1.34
  Bottom Layer w0.152: v1(76.41,96.28) 77.23,95.46 v1(77.23,83.96) ; v1(26.83,61.68) 26.83,81.39 27.1,81.66
M2_IN1: length 35.8
  Top Layer w0.152: v1(50.72,78.86) 49.99,78.13 21.22,78.13 19.04,80.32 U3.12
  Bottom Layer w0.152: v1(50.72,78.86) 51.14,78.44 U19.2
M2_IN2: length 34.7
  Top Layer w0.152: U3.11 18.57,77.6 v1(50.53,77.6)
  Bottom Layer w0.152: U19.3 50.95,77.17 v1(50.53,77.6)
M2_O1: length 14.8
  Top Layer w0.152: v1(6.72,75.56) 4.51,77.78 U3.6
  Bottom Layer w0.152: v1(6.72,75.56) 6.72,68.24 8.33,66.63
M2_O2: length 28.6
  Top Layer w0.152: v1(0.51,56.24) 2.62,54.13 8.33,54.13
  Bottom Layer w0.152: v1(0.51,56.24) 0.51,73.51 2.24,75.24 U3.7
M2_PWM: length 39.9
  Top Layer w0.152: v1(23.25,63.56) 23.48,63.79 43.31,63.79 U1.51
  Bottom Layer w0.152: U3.10 18.56,75.24 23.25,70.55 v1(23.25,63.56)
M3_E1: length 114.3
  Top Layer w0.152: 91.93,43.89 90.66,45.17 46.6,45.17 v1(39.74,52.02)
  Bottom Layer w0.152: 29.39,106.35 36.52,99.22 36.52,89.89 36.45,89.89 36.38,89.82 36.38,55.38 v1(39.74,52.02)
M3_E2: length 113.2
  Top Layer w0.152: v1(50.5,47.23) 51.34,46.39 91.93,46.39 ; v1(49.62,89.6) 35.62,89.6 32.49,92.73 v1(32.49,95.87)
  Bottom Layer w0.152: v1(49.62,89.6) 49.62,74.97 50.29,74.29 50.29,70.65 51.06,69.88 51.06,47.79 v1(50.5,47.23) ; 29.39,101.27 30.81,99.85 30.81,97.55 v1(32.49,95.87)
M3_IN1: length 29.3
  Top Layer w0.152: v1(57.58,76.39) 58.87,77.68 U4.14
  Bottom Layer w0.152: v1(57.58,76.39) 57.09,75.9 52.84,75.9
M3_IN2: length 28.8
  Top Layer w0.152: U4.15 81.29,75.03 v1(55.46,75.03)
  Bottom Layer w0.152: v1(55.46,75.03) 55.06,74.63 U19.5
M3_O1: length 45.7
  Bottom Layer w0.152: 91.93,38.89 95.35,38.89 95.35,78.34 97.23,80.22 U4.4
M3_O2: length 33.7
  Bottom Layer w0.152: 91.93,51.39 91.93,77.45 97.23,82.76 U4.5
M3_PWM: length 38.7
  Top Layer w0.152: U4.16 75.48,66.69 56.42,66.69 53.72,63.99 53.72,58.15 U1.56
M4_E1: length 92.9
  Top Layer w0.152: 92.1,102.96 79.7,102.96 74.2,97.46 44.77,97.46 v1(44.31,97)
  Bottom Layer w0.152: v1(44.31,97) 38.94,91.63 38.94,58 U1.46
M4_E2: length 26.1
  Top Layer w0.152: 70.39,98.73 71.66,100 74.35,100 74.35,102.73 77.08,105.46 92.1,105.46
M4_IN1: length 35.4
  Top Layer w0.152: v1(58.53,81.17) 60.12,82.76 U4.12
  Bottom Layer w0.152: U19.6 55.74,73.36 58.53,76.15 v1(58.53,81.17)
M4_IN2: length 36.1
  Top Layer w0.152: U4.11 65.06,85.3 v1(64.51,84.75)
  Bottom Layer w0.152: U19.7 55.31,72.09 64.51,81.29 v1(64.51,84.75)
M4_O1: length 15
  Bottom Layer w0.152: U4.6 97.23,85.3 92.1,90.43 92.1,97.96
M4_O2: length 26.3
  Bottom Layer w0.152: U4.7 97.55,87.84 99.13,89.41 99.13,103.44 92.1,110.46
M4_PWM: length 63.8
  Top Layer w0.152: v1(32.86,97) 33.02,96.83 33.02,95.96 34.06,94.92 74.01,94.92 74.35,94.58 74.35,90 76.51,87.84 U4.10
  Bottom Layer w0.152: v1(32.86,97) 32.86,100.34 29.39,103.81
OLED_CS: length 112.6
  Top Layer w0.152: v1(69.78,43.43) 68.86,42.52 45.15,42.52 38.92,36.29 33.82,36.29 U11.7
  Bottom Layer w0.152: v1(69.78,43.43) 71.66,45.31 71.66,100 70.39,101.27
OLED_DC: length 124.4
  Top Layer w0.152: v1(68.06,93.65) 38.5,93.65 v1(35.63,90.78)
  Bottom Layer w0.152: v1(35.63,90.78) 33.71,90.78 33.71,56.22 33.09,55.6 33.09,33.57 27.05,27.52 22.52,27.52 U11.6 ; 72.93,106.35 71.66,105.08 69.12,105.08 68.06,104.02 v1(68.06,93.65)
OLED_RST: length 108.4
  Top Layer w0.152: 72.93,88.57 70.47,86.11 33.9,86.11 v1(32.8,85.01)
  Bottom Layer w0.152: U11.5 20.53,28.08 23.71,28.08 32.65,37.02 32.65,84.86 v1(32.8,85.01)
OLED_SCL: length 74.5
  Top Layer w0.152: U11.3 13.38,29.53 v1(13.16,29.76)
  Bottom Layer w0.152: v1(13.16,29.76) 27.89,44.49 27.89,86.01 28,86.01 28.12,86.13 28.12,92.38 29.39,93.65
OLED_SDA: length 124.9
  Top Layer w0.152: v1(31.48,88.09) 31.48,96.82 37.2,102.54 71.66,102.54 72.93,103.81
  Bottom Layer w0.152: U11.4 19.11,29.2 23.99,29.2 32.05,37.26 32.05,87.53 v1(31.48,88.09)
RES: length 97.5
  Top Layer w0.152: v1(75.08,67.78) 74.84,67.53 53.73,67.53 v1(51.82,65.62) ; R6.2 48.48,41.74 50.78,41.74 50.78,38.98 KEY4.3 KEY4.4
  Bottom Layer w0.152: 72.93,101.27 75.08,99.11 v1(75.08,67.78) ; v1(51.82,65.62) 51.49,65.29 51.49,39.7 KEY4.3
RX1: length 23.2
  Top Layer w0.152: 26.85,88.57 23.81,91.61 23.81,97.06 15.32,105.55 U21.3
SCL1: length 42
  Top Layer w0.152: 91.52,63.13 96.63,63.13 U18.3 ; U1.62 61.57,55.69 62.9,55.69 64.08,56.87 64.08,57.63 64.82,58.37 68.4,58.37 68.76,58.73 68.76,61.24 70.64,63.12 R7.2
SCL2: length 88.8
  Top Layer w0.152: 17.8,41.77 17.51,41.48 R9.2 4.01,41.48 U5.3 ; v1(20.64,103.83) 20.66,103.81 U1.7
  Bottom Layer w0.152: v1(17.81,41.79) 18.85,42.83 18.85,46.62 18.83,46.64 18.83,46.66 arc(18.69,47) 18.34,47.14 arc(18,47.28) 17.86,47.63 17.86,48.18 arc(18,48.52) 18.34,48.66 arc(18.69,48.81) 18.83,49.15 18.83,49.7 arc(18.69,50.05) 18.34,50.19 arc(18,50.33) 17.86,50.67 17.86,51.23 arc(18,51.57) 18.34,51.71 arc(18.69,51.85) 18.83,52.2 18.85,66.43 15.34,69.94 15.34,98.81 20.36,103.83 20.64,103.83 v1(20.64,103.83)
SDA1: length 41.9
  Top Layer w0.152: 91.48,65.6 U18.4 ; 91.48,65.6 90.52,65.62 arc(90,65.83) 89.78,66.36 arc(89.56,66.88) 89.04,67.1 89,67.1 arc(88.47,66.88) 88.26,66.36 arc(88.04,65.83) 87.52,65.62 87.47,65.62 arc(86.95,65.83) 86.73,66.36 arc(86.52,66.88) 85.99,67.1 85.95,67.1 arc(85.42,66.88) 85.21,66.36 arc(84.99,65.83) 84.47,65.62 82.2,65.62 82.18,65.6 69.57,65.6 63.91,59.94 63.91,58.18 U1.64 ; 91.48,65.6 R8.2
SDA2: length 88.6
  Top Layer w0.152: v1(20.64,103.11) 25,103.11 U1.9 ; v1(18.18,40.4) 16.64,38.86 R10.2 3.93,38.86 U5.4
  Bottom Layer w0.152: 15.65,89.09 15.65,70.07 19.16,66.56 19.16,41.37 v1(18.18,40.4) ; 15.65,89.09 15.65,89.14 ; 15.65,89.09 16.24,89.68 16.24,98.67 20.64,103.07 v1(20.64,103.11)
TX1: length 22.3
  Top Layer w0.152: U21.2 25.43,96.54 25.43,92.53 26.85,91.11
$1N3300: length 3.1
  Top Layer w0.152: U3.13 18.41,82.87 R1.1
$1N3306: length 3.6
  Top Layer w0.152: R2.1 81.35,80.26 U4.13
$1N3954: length 2.7
  Bottom Layer w0.152: 47.36,70.82 45.72,70.82 R3.1
$1N3999: length 2.5
  Bottom Layer w0.152: R4.1 45.12,72.09 U19.10
$1N4038: length 2.4
  Bottom Layer w0.152: 47.36,75.9 44.94,75.9 R5.1
$1N7175: length 6.1
  Top Layer w0.152: BUZZER2.2 29.02,49.62 v1(29.02,52.98)
  Bottom Layer w0.152: Q1.3 29.98,52.98 v1(29.02,52.98)
$1N7178: length 4.1
  Bottom Layer w0.152: 29.2,56.78 R46.2 ; 29.2,56.78 Q1.1 ; 29.2,56.78 29.2,58.49 R41.1
$1N7182: length 7.7
  Top Layer w0.762: R45.2 37.78,48.46 BUZZER2.1
$1N9172: length 1.9
  Top Layer w0.762: R58.1 54.7,22.71 LED2.2
$1N10907: length 11.1
  Top Layer w0.152: SW1.5 90.54,27.9 U2.2
  Bottom Layer w0.152: SW1.2 SW1.5

## Copper pours and planes (outline as drawn; the poured copper is in the pictures)
GND on Top Layer: -13.79,113.53 112.84,113.53 112.84,-8.41 -13.79,-8.41
GND on Bottom Layer: -19.43,123.95 122.54,123.95 122.54,-8.43 -19.43,-8.43
